# EAGLE design TLC59731_Arduino_UNO_R3_Shield (EAGLE 7.4.0)
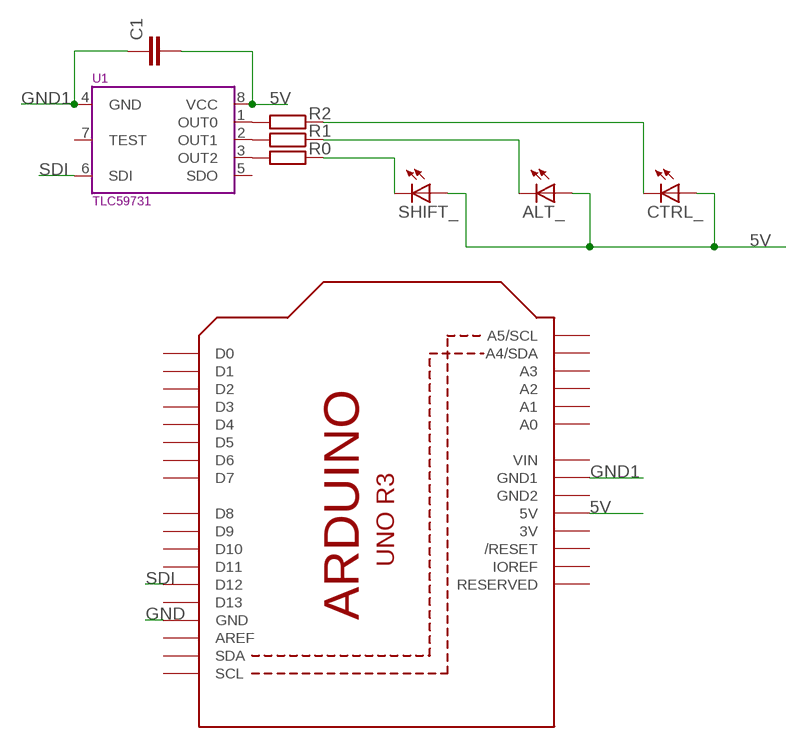
[diagram p0: schematic, sheet 1]

## Parts
ALT_  LEDSMT1206  [1206]
C1  CC0402  [C0402]
CTRL_  LEDSMT1206  [1206]
M2  ARDUINO_UNO_R3_EXT  [ARDUINO_UNO_R3_EXT]
R0  R_0402  [R0402]
R1  R_0402  [R0402]
R2  R_0402  [R0402]
SHIFT_  LEDSMT1206  [1206]
U1  TLC59731  [SOIC8_208MIL]

## Nets
5V: ALT_.A C1.2 CTRL_.A M2.5V SHIFT_.A U1.8(VCC)
GND: M2.GND
GND1: C1.1 M2.GND1 U1.4(GND)
N$1: R0.2 U1.3(OUT2)
N$2: R1.2 U1.2(OUT1)
N$3: R2.2 U1.1(OUT0)
N$4: R0.1 SHIFT_.C
N$5: ALT_.C R1.1
N$6: CTRL_.C R2.1
SDI: M2.D12 U1.6(SDI)
Unconnected: M2.A0 M2.A1 M2.A2 M2.A3 M2.A4(A4/SDA) M2.A5(A5/SCL) M2.AREF M2.D0 M2.D1 M2.D2 M2.D3 M2.D4 M2.D5 M2.D6 M2.D7 M2.D8 M2.D9 M2.D10 M2.D11 M2.D13 M2.IOREF M2.RESERVED M2.RESET(/RESET) M2.SCL M2.SDA U1.5(SDO) U1.7(TEST)

## Power pins joined to a net without a drawn wire
3V: M2.3V
GND2: M2.GND2
VIN: M2.VIN

## Library data of the parts
ALT_ CTRL_ SHIFT_ = adafruit:LED: LED OSRAM: - CHIPLED LG R971, LG N971, LY N971, LG Q971, LY Q971, LO R971, LY R971 LH N974, LH R974 LS Q976, LO Q976, LY Q976 LO Q996 - Hyper CHIPLED LW Q18S LB Q993, LB Q99A, LB R99A - SideLED LS A670, LO A670, LY A670, LG A670, LP A670 LB A673, LV A673, LT A673, LW A673 LH A674 LY A675 LS A676, LA A676, LO A676, LY A676, LW A676 LS A679, LY A679, LG A679 - Hyper Micro SIDELED® LS Y876, LA Y876, LO Y876, LY Y876 LT Y87S - SmartLED LW L88C, LW L88S LB L89C, LB L89S, LG L890 LS L89K, LO L89K, LY L89K LS L896, LA L896, LO L896, LY L896 - TOPLED LS T670, LO T670, LY T670, LG T670, LP T670 LSG T670, LSP T670, LSY T670, LOP T670, LYG T670 LG T671, LOG T671, LSG T671 LB T673, LV T673, LT T673, LW T673 LH T674 LS T676, LA T676, LO T676, LY T676, LB T676, LH T676, LSB T676, LW T676 LB T67C, LV T67C, LT T67C, LS T67K, LO T67K, LY T67K, LW E67C LS E67B, LA E67B, LO E67B, LY E67B, LB E67C, LV E67C, LT E67C LW T67C LS T679, LY T679, LG T679 LS T770, LO T770, LY T770, LG T770, LP T770 LB T773, LV T773, LT T773, LW T773 LH T774 LS E675, LA E675, LY E675, LS T675 LS T776, LA T776, LO T776, LY T776, LB T776 LHGB T686 LT T68C, LB T68C - Hyper Mini TOPLED® LB M676 - Mini TOPLED Santana® LG M470 LS M47K, LO M47K, LY M47K Source: http://www.osram.convergy.de/
C1 = eagle-ltspice:C: CAPACITOR, European symbol; SPICEMODEL: NONE; SPICEPREFIX: C
M2 = DIT_arduino:ARDUINO_UNO_R3_EXT
R0 R1 R2 = DIT_smd:R_0402
U1 = DIT_smd:TLC59731: 3-Channel, 8-Bit, PWM LED Driver with Single-Wire Interface ( EasySet™) Texas Instruments Digi-Key Part Number: 296-40590-1-ND

## Board
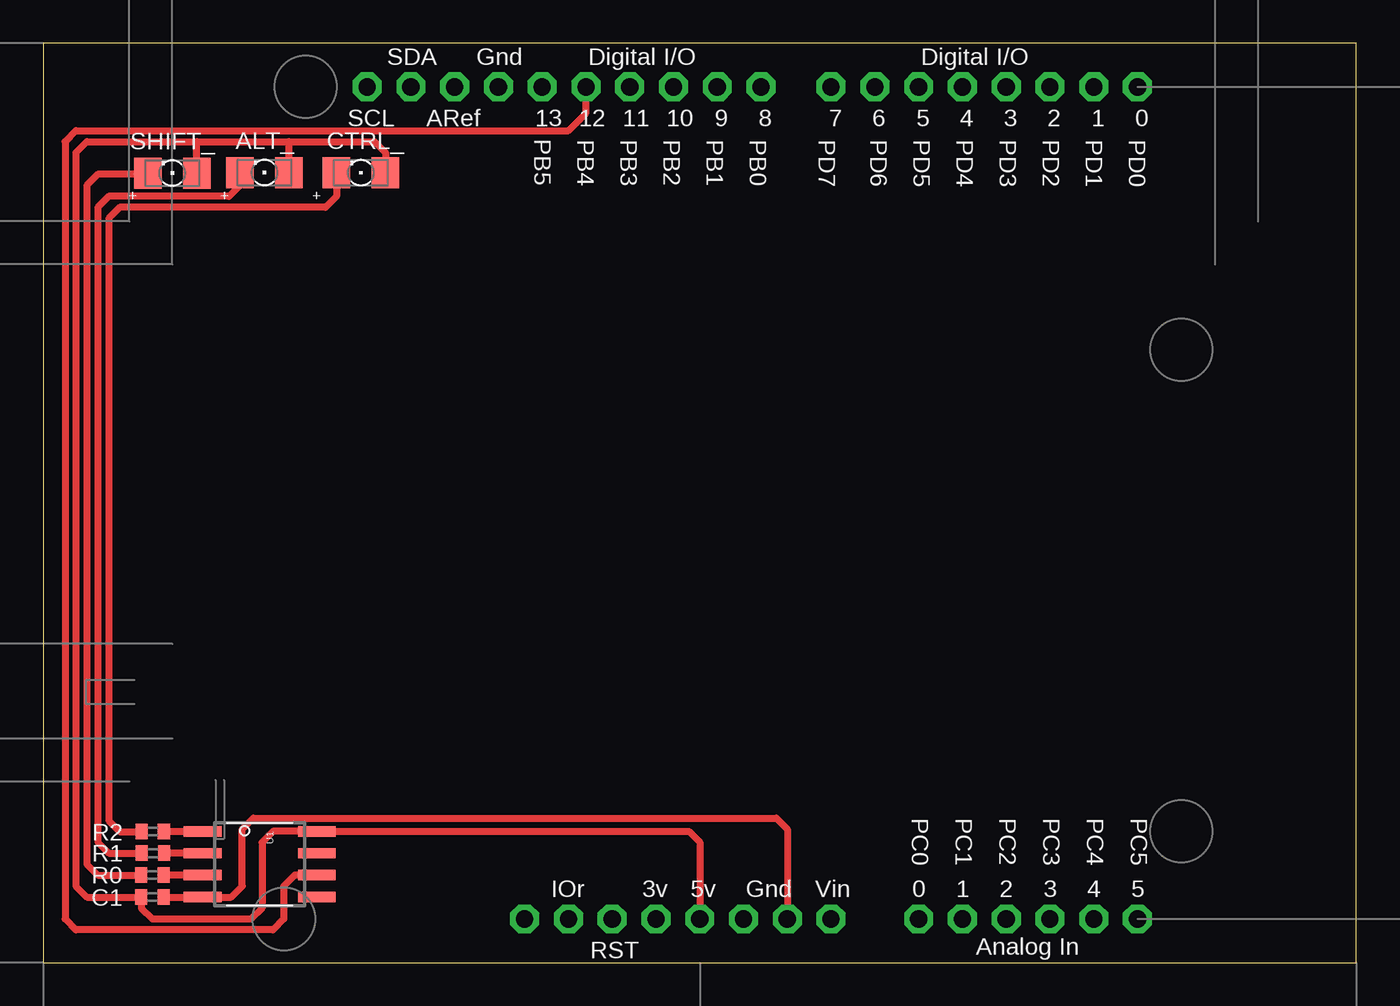
[diagram p1: board, top side]

Size 76.2 x 53.34 mm. Coordinates in mm from the lower left corner, seen from the top.
Copper layers (1*16): Top 0.035mm / dielectric 1.5mm / Bottom 0.035mm
Design rules "default": minimum track width 10mil, minimum drill 24mil, track to track 8mil, track to pad 8mil, pad to pad 8mil, via to via 8mil, smd to smd 8mil, copper to edge 40mil, drill to drill 8mil, minimum pad ring 10mil, minimum via ring 8mil, stop-mask expansion 4mil, vias tented up to drill 0mil, thermal gap 10mil

### Footprints (pad centres in the part's own frame; a part is rotated, then mirrored left to right if it is on the bottom)
1206 = smd 1.6 x 1.803: A -1.422,0; C 1.422,0
C0402 = smd 0.7 x 0.9: 1 -0.65,0; 2 0.65,0
ARDUINO_UNO_R3_EXT = drill 1 pad 1.676 octagon: 3V 35.56,2.54; 5V 38.1,2.54; A0 50.8,2.54; A1 53.34,2.54; A2 55.88,2.54; A3 58.42,2.54; A4 60.96,2.54; A5 63.5,2.54; AREF 23.876,50.8; D0 63.5,50.8; D1 60.96,50.8; D2 58.42,50.8; D3 55.88,50.8; D4 53.34,50.8; D5 50.8,50.8; D6 48.26,50.8; D7 45.72,50.8; D8 41.656,50.8; D9 39.116,50.8; D10 36.576,50.8; D11 34.036,50.8; D12 31.496,50.8; D13 28.956,50.8; GND 26.416,50.8; GND1 43.18,2.54; GND2 40.64,2.54; IOREF 30.48,2.54; RESERVED 27.94,2.54; RESET 33.02,2.54; SCL 18.796,50.8; SDA 21.336,50.8; VIN 45.72,2.54
R0402 = smd 0.7 x 0.9: 1 -0.65,0; 2 0.65,0
SOIC8_208MIL = smd 0.6 x 2.2: 1 -1.905,-3.315; 2 -0.635,-3.315; 3 0.635,-3.315; 4 1.905,-3.315; 5 1.905,3.315; 6 0.635,3.315; 7 -0.635,3.315; 8 -1.905,3.315

### Placement (x,y rotation side)
ALT_  12.85,45.83 180 top
C1  6.35,3.81 180 top
CTRL_  18.44,45.82 180 top
M2  0,0 0 top
R0  6.34,5.08 0 top
R1  6.37,6.35 0 top
R2  6.36,7.61 0 top
SHIFT_  7.49,45.8 180 top
U1  12.57,5.71 270 top

### Tracks (layer width: path | path; a pad name or v marks a point on that pad's centre or on a via)
5V
  Top 0.406: M2.5V 38.1,6.99 37.47,7.62 U1.8 13.34,7.62 12.7,6.99 12.7,3.17 12.06,2.54 6.33,2.54 5.7,3.17 C1.2 2.54,3.81 1.91,4.45 1.91,46.99 2.54,47.62 8.92,47.62 | SHIFT_.A 8.92,47.62 | 8.92,47.62 14.27,47.62 | ALT_.A 14.27,47.62 | 14.27,47.62 19.23,47.62 19.86,46.99 CTRL_.A
GND1
  Top 0.406: M2.GND1 43.18,7.75 42.55,8.38 12.19,8.38 11.56,7.75 11.56,4.45 10.92,3.81 U1.4 C1.1
N$1
  Top 0.406: U1.3 R0.2
N$2
  Top 0.406: U1.2 R1.2
N$3
  Top 0.406: U1.1 9.25,7.61 R2.2
N$4
  Top 0.406: SHIFT_.C 6,45.72 3.17,45.72 2.54,45.09 2.54,5.72 3.17,5.08 R0.1
N$5
  Top 0.406: ALT_.C 11.43,45.09 10.79,44.45 3.81,44.45 3.17,43.81 3.17,6.99 3.81,6.36 R1.1
N$6
  Top 0.406: CTRL_.C 17.02,44.45 16.39,43.81 4.45,43.81 3.81,43.18 3.81,8.24 4.45,7.61 R2.1
SDI
  Top 0.406: 31.75,50.8 M2.D12 31.5,49.28 30.48,48.26 1.91,48.26 1.27,47.62 1.27,2.54 1.91,1.91 13.34,1.91 13.97,2.54 13.97,4.45 14.61,5.08 U1.6

### Text on the board
tPlace: PB5 | PB4 | PB3 | PB2 | PB1 | PB0 | PD7 | PD6 | PD5 | PD4 | PD3 | PD2 | PD1 | PD0 | + | + | + | PC0 | PC1 | PC2 | PC3 | PC4 | PC5
tDocu: ¾ | ³ | § | ≥ | € | ≤ | ¥ | ´